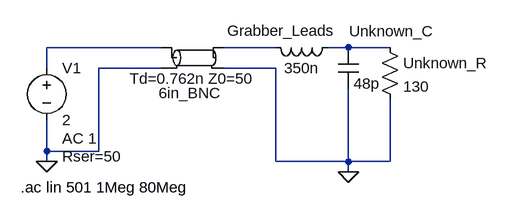
[diagram p0: schematic EC_Model.asc]
EC_Model.asc, the LTspice schematic file:
Version 4.1
SHEET 1 880 680
WIRE 272 128 96 128
WIRE 448 128 368 128
WIRE 560 128 528 128
WIRE 624 128 560 128
WIRE 96 160 96 128
WIRE 272 160 176 160
WIRE 448 160 368 160
WIRE 96 288 96 240
WIRE 176 288 176 160
WIRE 176 288 96 288
WIRE 96 304 96 288
WIRE 448 304 448 160
WIRE 560 304 560 192
WIRE 560 304 448 304
WIRE 624 304 624 208
WIRE 624 304 560 304
WIRE 560 320 560 304
FLAG 96 304 0
FLAG 560 320 0
SYMBOL voltage 96 144 R0
WINDOW 123 24 124 Left 2
WINDOW 39 24 152 Left 2
SYMATTR Value2 AC 1
SYMATTR SpiceLine Rser=50
SYMATTR InstName V1
SYMATTR Value 2
SYMBOL tline 320 144 R0
WINDOW 0 -4 70 Bottom 2
SYMATTR InstName 6in_BNC
SYMATTR Value Td=0.762n Z0=50
SYMBOL res 608 112 R0
SYMATTR InstName Unknown_R
SYMATTR Value 130
SYMBOL cap 544 128 R0
WINDOW 0 17 -25 Left 2
SYMATTR InstName Unknown_C
SYMATTR Value 48p
SYMBOL ind 544 112 R90
WINDOW 0 6 86 VBottom 2
WINDOW 3 32 56 VTop 2
SYMATTR InstName Grabber_Leads
SYMATTR Value 350n
SYMATTR SpiceLine Rser=1m
TEXT 56 344 Left 2 !.ac lin 501 1Meg 80Meg

The netlist it stands for:
* EC_Model.asc
V1 N001 0 2 AC 1 Rser=50
T§6in_BNC N001 0 N002 0 Td=0.762n Z0=50
R§Unknown_R N003 0 130
C§Unknown_C N003 0 48p
L§Grabber_Leads N003 N002 350n Rser=1m
.ac lin 501 1Meg 80Meg
.backanno
.end